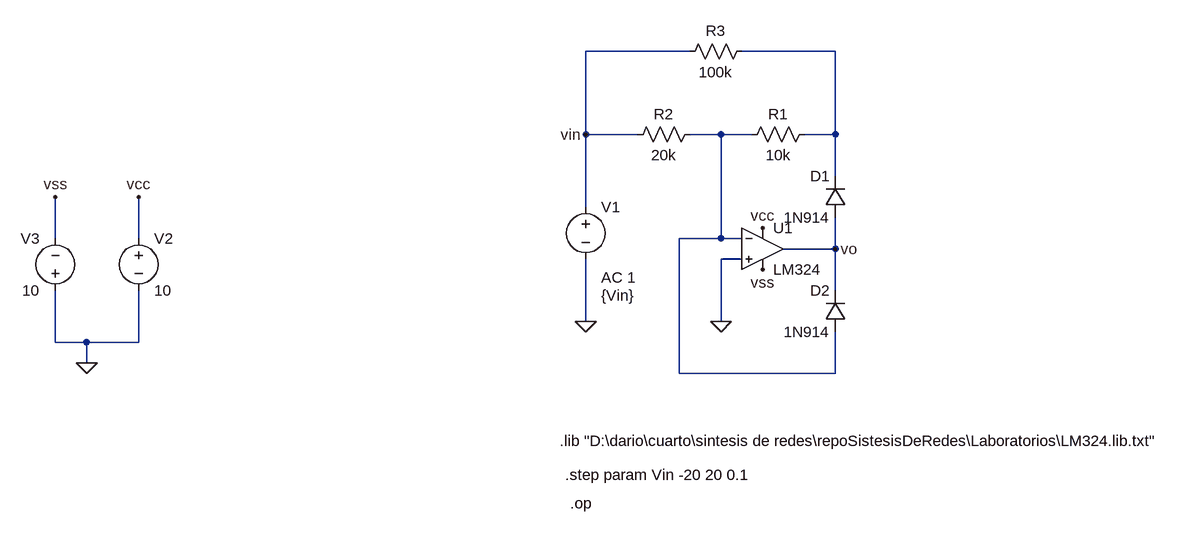
[diagram p0: schematic ejer1_18.asc]
ejer1_18.asc, the LTspice schematic file:
Version 4
SHEET 1 1204 680
WIRE 80 -160 -80 -160
WIRE 304 -160 160 -160
WIRE -80 -32 -80 -160
WIRE 0 -32 -80 -32
WIRE 128 -32 80 -32
WIRE 176 -32 128 -32
WIRE 304 -32 304 -160
WIRE 304 -32 256 -32
WIRE 304 32 304 -32
WIRE -80 80 -80 -32
WIRE -896 128 -896 64
WIRE -768 128 -768 64
WIRE 128 128 128 -32
WIRE 128 128 64 128
WIRE 160 128 128 128
WIRE 304 144 304 96
WIRE 304 144 224 144
WIRE 160 160 128 160
WIRE 304 208 304 144
WIRE -80 256 -80 160
WIRE 128 256 128 160
WIRE -896 288 -896 208
WIRE -848 288 -896 288
WIRE -768 288 -768 208
WIRE -768 288 -848 288
WIRE -848 320 -848 288
WIRE 64 336 64 128
WIRE 304 336 304 272
WIRE 304 336 64 336
FLAG -848 320 0
FLAG -80 256 0
FLAG 128 256 0
FLAG 304 144 vo
FLAG -80 -32 vin
FLAG -768 64 vcc
FLAG -896 64 vss
FLAG 192 112 vcc
FLAG 192 176 vss
SYMBOL Opamps\\opamp2 192 80 R0
SYMATTR InstName U1
SYMATTR Value LM324
SYMBOL voltage -80 64 R0
WINDOW 3 24 152 Left 2
WINDOW 123 24 124 Left 2
WINDOW 39 0 0 Left 0
SYMATTR InstName V1
SYMATTR Value {Vin}
SYMATTR Value2 AC 1
SYMBOL voltage -768 112 R0
WINDOW 123 0 0 Left 0
WINDOW 39 0 0 Left 0
SYMATTR InstName V2
SYMATTR Value 10
SYMBOL voltage -896 224 R180
WINDOW 0 24 96 Left 2
WINDOW 3 24 16 Left 2
WINDOW 123 0 0 Left 0
WINDOW 39 0 0 Left 0
SYMATTR InstName V3
SYMATTR Value 10
SYMBOL res 272 -48 R90
WINDOW 0 0 56 VBottom 2
WINDOW 3 32 56 VTop 2
SYMATTR InstName R1
SYMATTR Value 10k
SYMBOL res 96 -48 R90
WINDOW 0 0 56 VBottom 2
WINDOW 3 32 56 VTop 2
SYMATTR InstName R2
SYMATTR Value 20k
SYMBOL res 176 -176 R90
WINDOW 0 0 56 VBottom 2
WINDOW 3 32 56 VTop 2
SYMATTR InstName R3
SYMATTR Value 100k
SYMBOL diode 320 96 R180
WINDOW 0 24 64 Left 2
WINDOW 3 24 0 Left 2
SYMATTR InstName D1
SYMATTR Value 1N914
SYMBOL diode 320 272 R180
WINDOW 0 24 64 Left 2
WINDOW 3 24 0 Left 2
SYMATTR InstName D2
SYMATTR Value 1N914
TEXT -120 440 Left 2 !.lib "D:\\dario\\cuarto\\sintesis de redes\\repoSistesisDeRedes\\Laboratorios\\LM324.lib.txt"
TEXT -112 492 Left 2 !.step param Vin -20 20 0.1
TEXT -104 536 Left 2 !.op

The netlist it stands for:
* ejer1_18.asc
XU1 0 N002 vcc vss vo LM324  ; pins In+ In- V+ V- OUT
V1 vin 0 {Vin} AC 1
V2 vcc 0 10
V3 0 vss 10
R1 N001 N002 10k
R2 N002 vin 20k
R3 N001 vin 100k
D1 vo N001 1N914
D2 N002 vo 1N914
.model D D
.lib standard.dio
.lib "D:\dario\cuarto\sintesis de redes\repoSistesisDeRedes\Laboratorios\LM324.lib.txt"
.step param Vin -20 20 0.1
.op
.backanno
.end

* Results of the author's LTspice run, read from the files saved beside the schematic
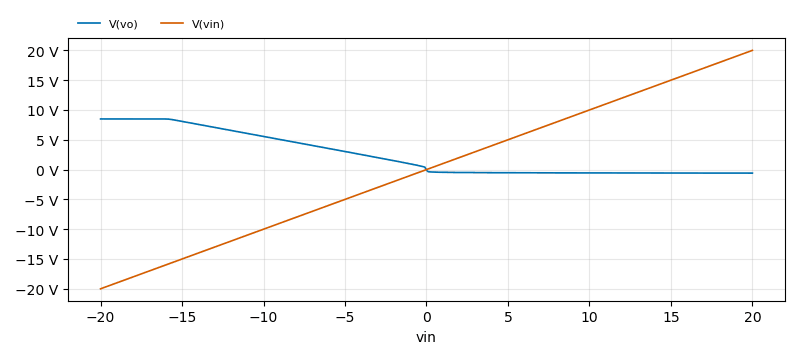
[diagram p1: Operating Point of ejer1_18.asc, plotted from the saved traces]
* Operating Point, 1 run:
*   V(vo): 8.496 V at vin=-20 , -592.4 mV at vin=20 , min -592.4 mV, max 8.496 V
*   V(vin): -20 V at vin=-20 , 20 V at vin=20 , min -20 V, max 20 V